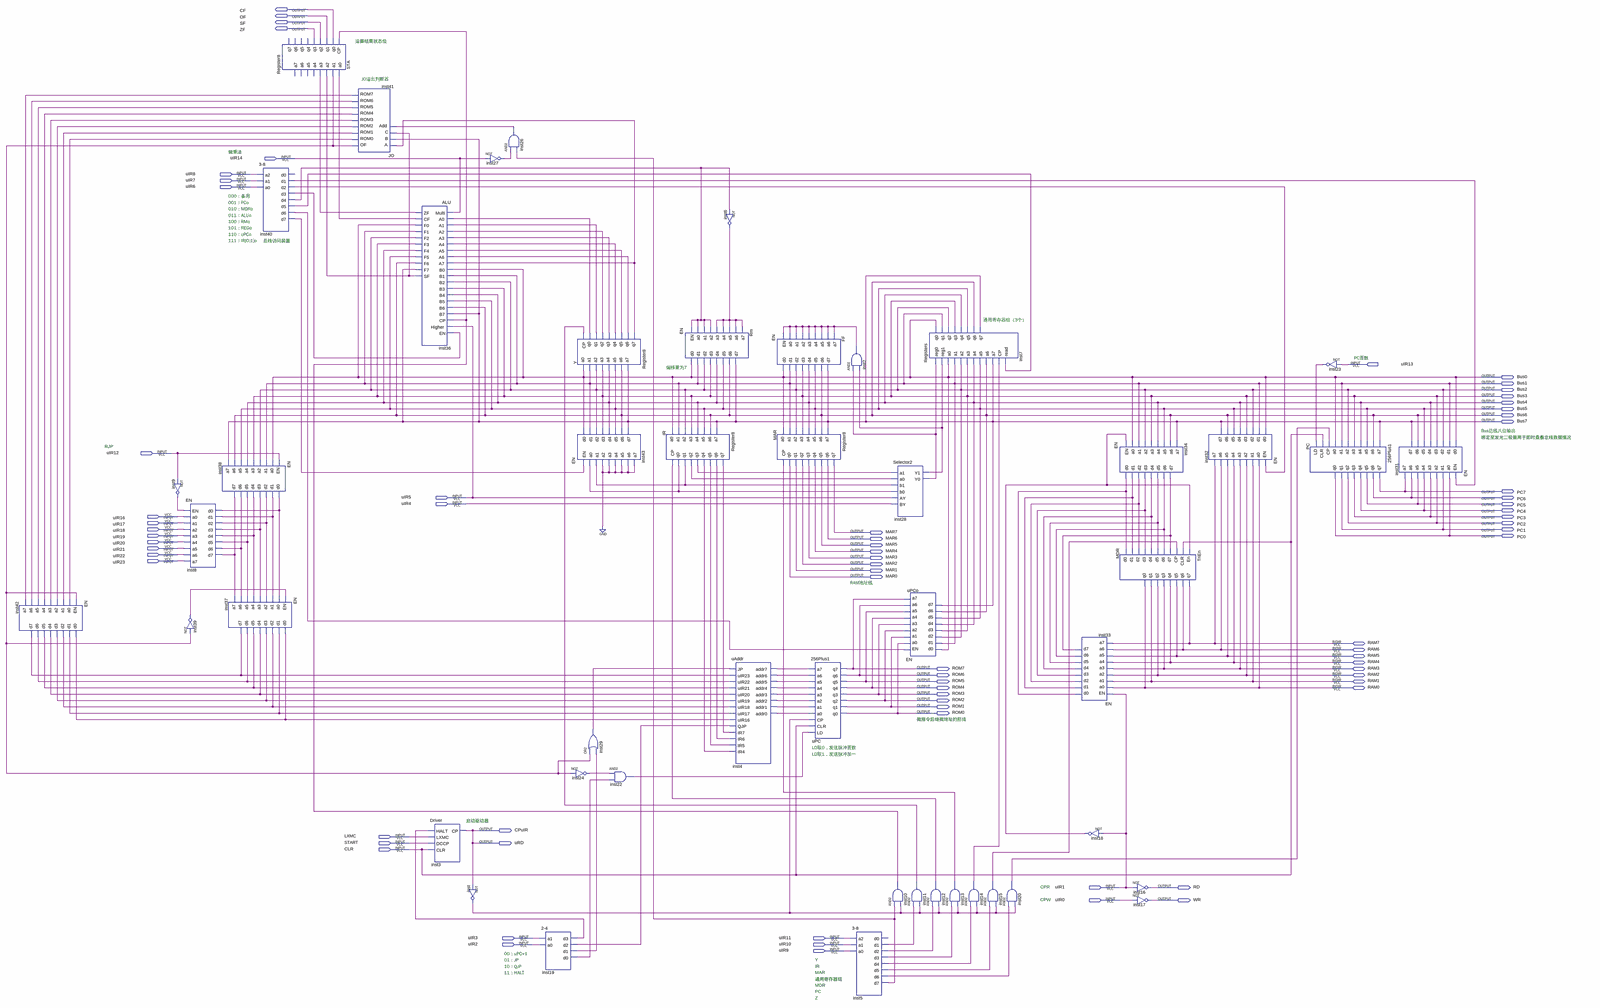
[diagram p0: schematic sheet, whole]
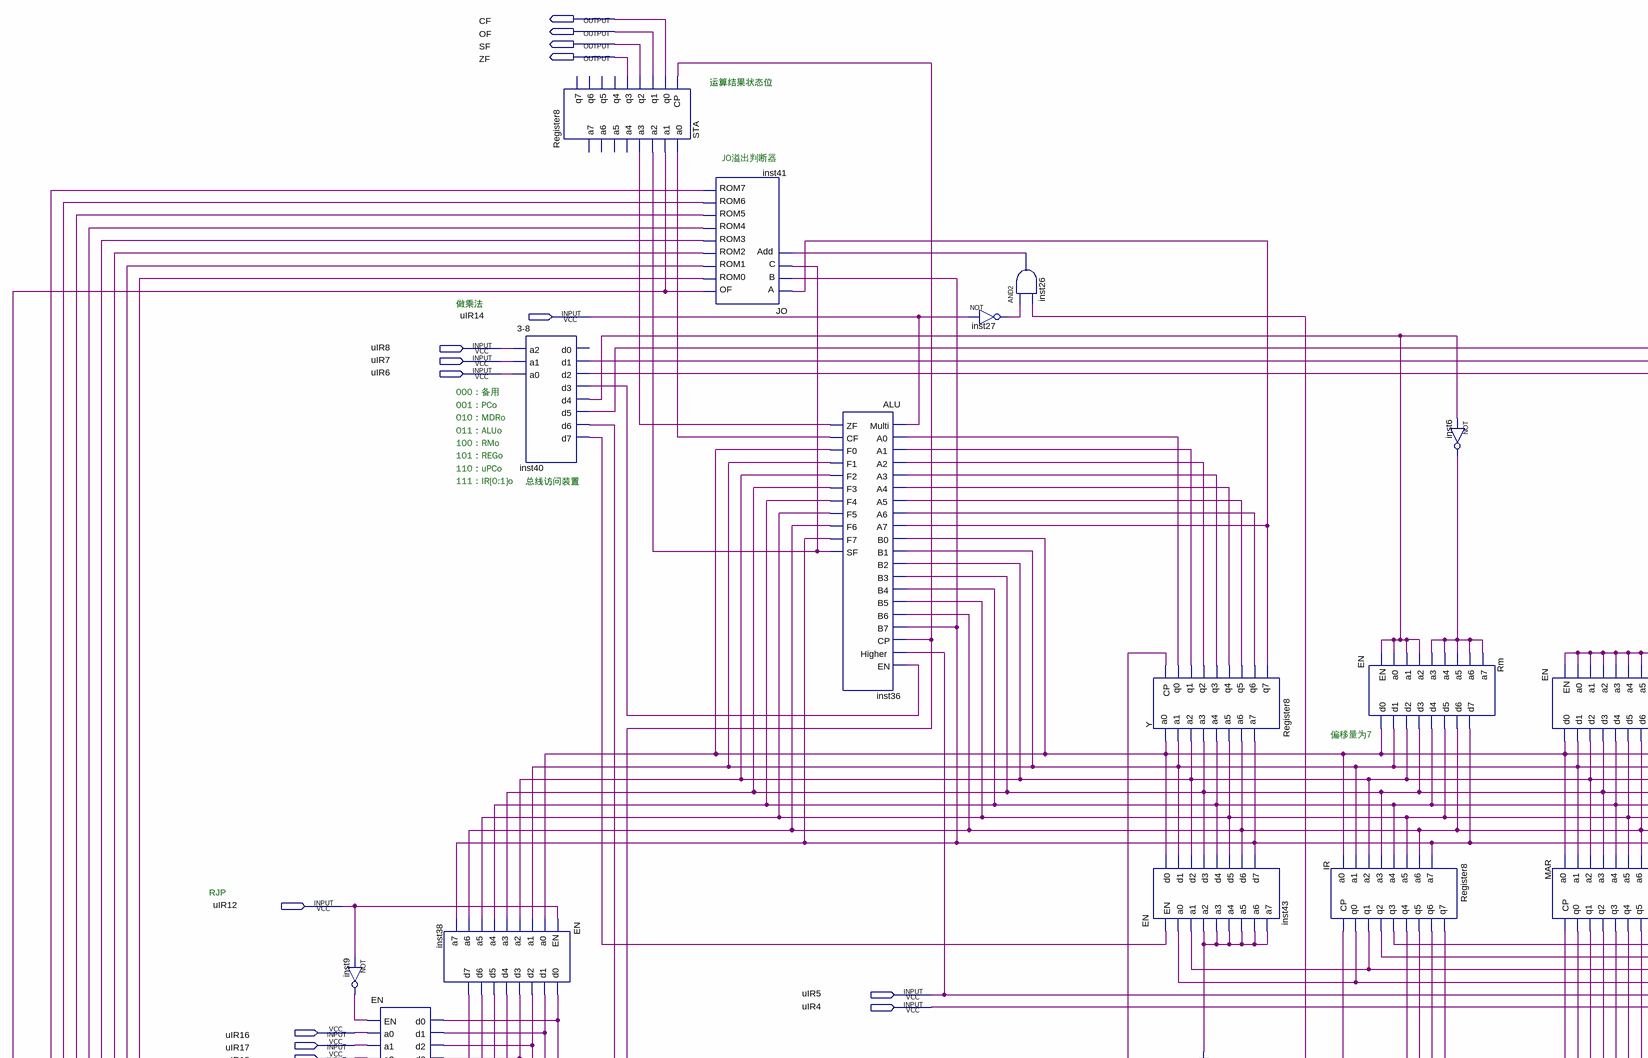
[diagram p1: schematic sheet, upper left part]
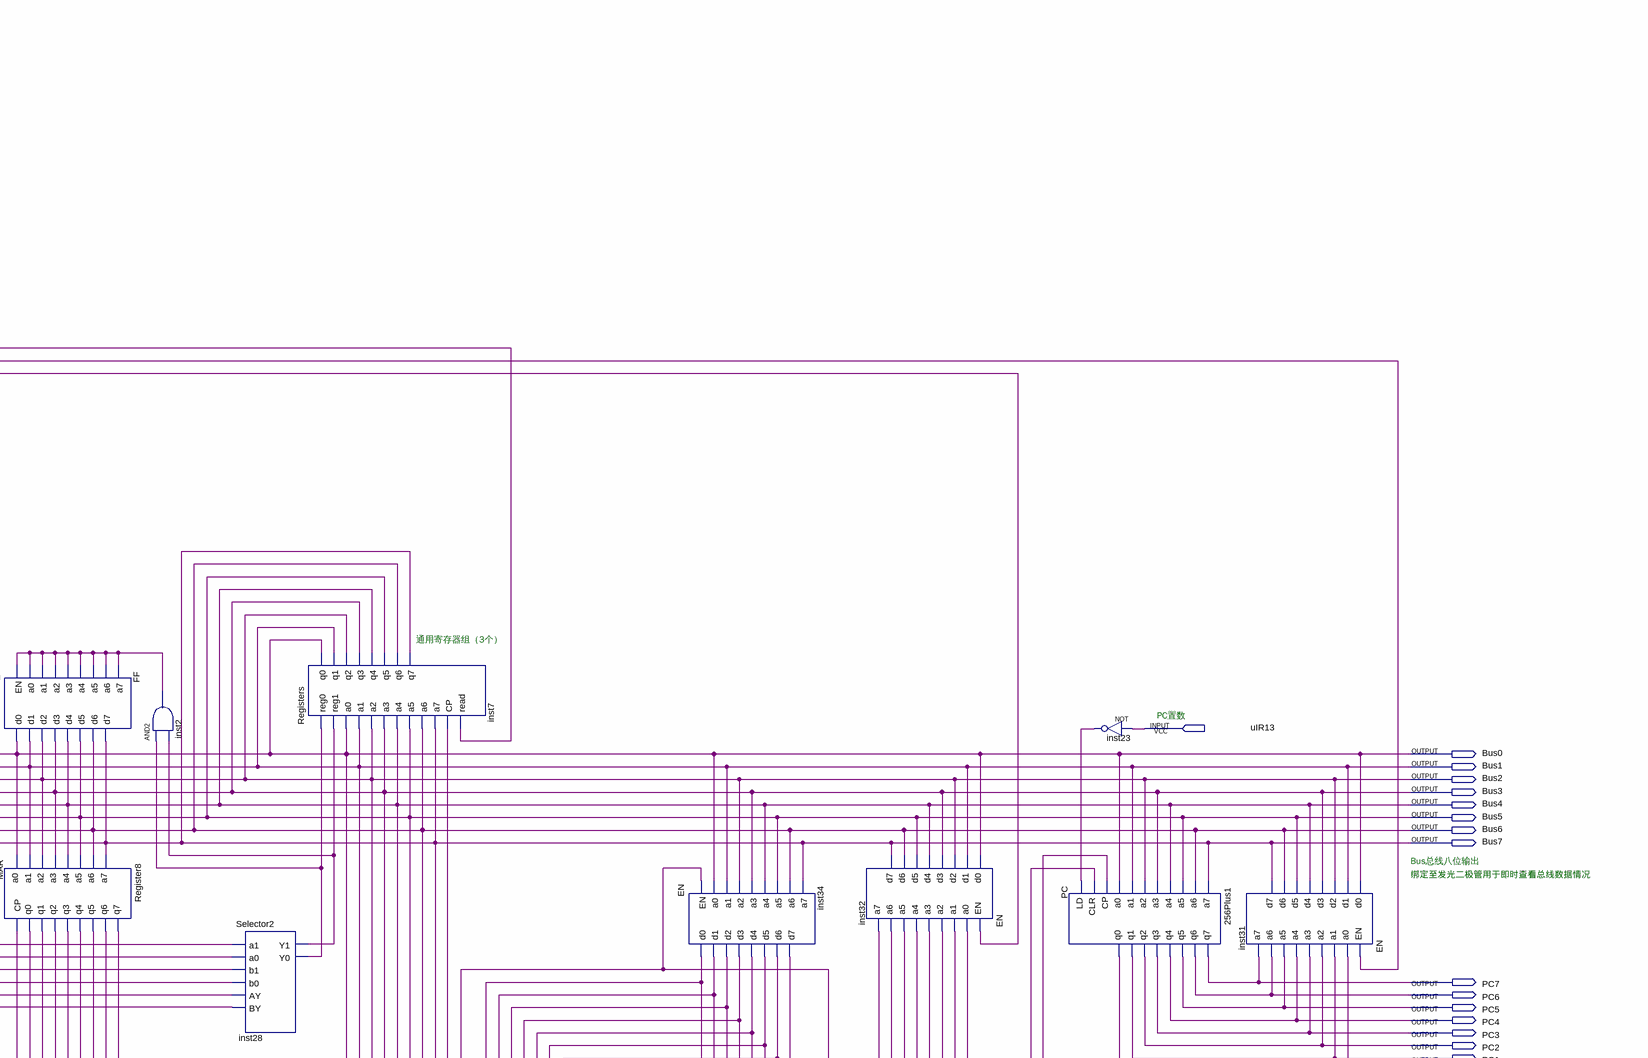
[diagram p2: schematic sheet, upper right part]
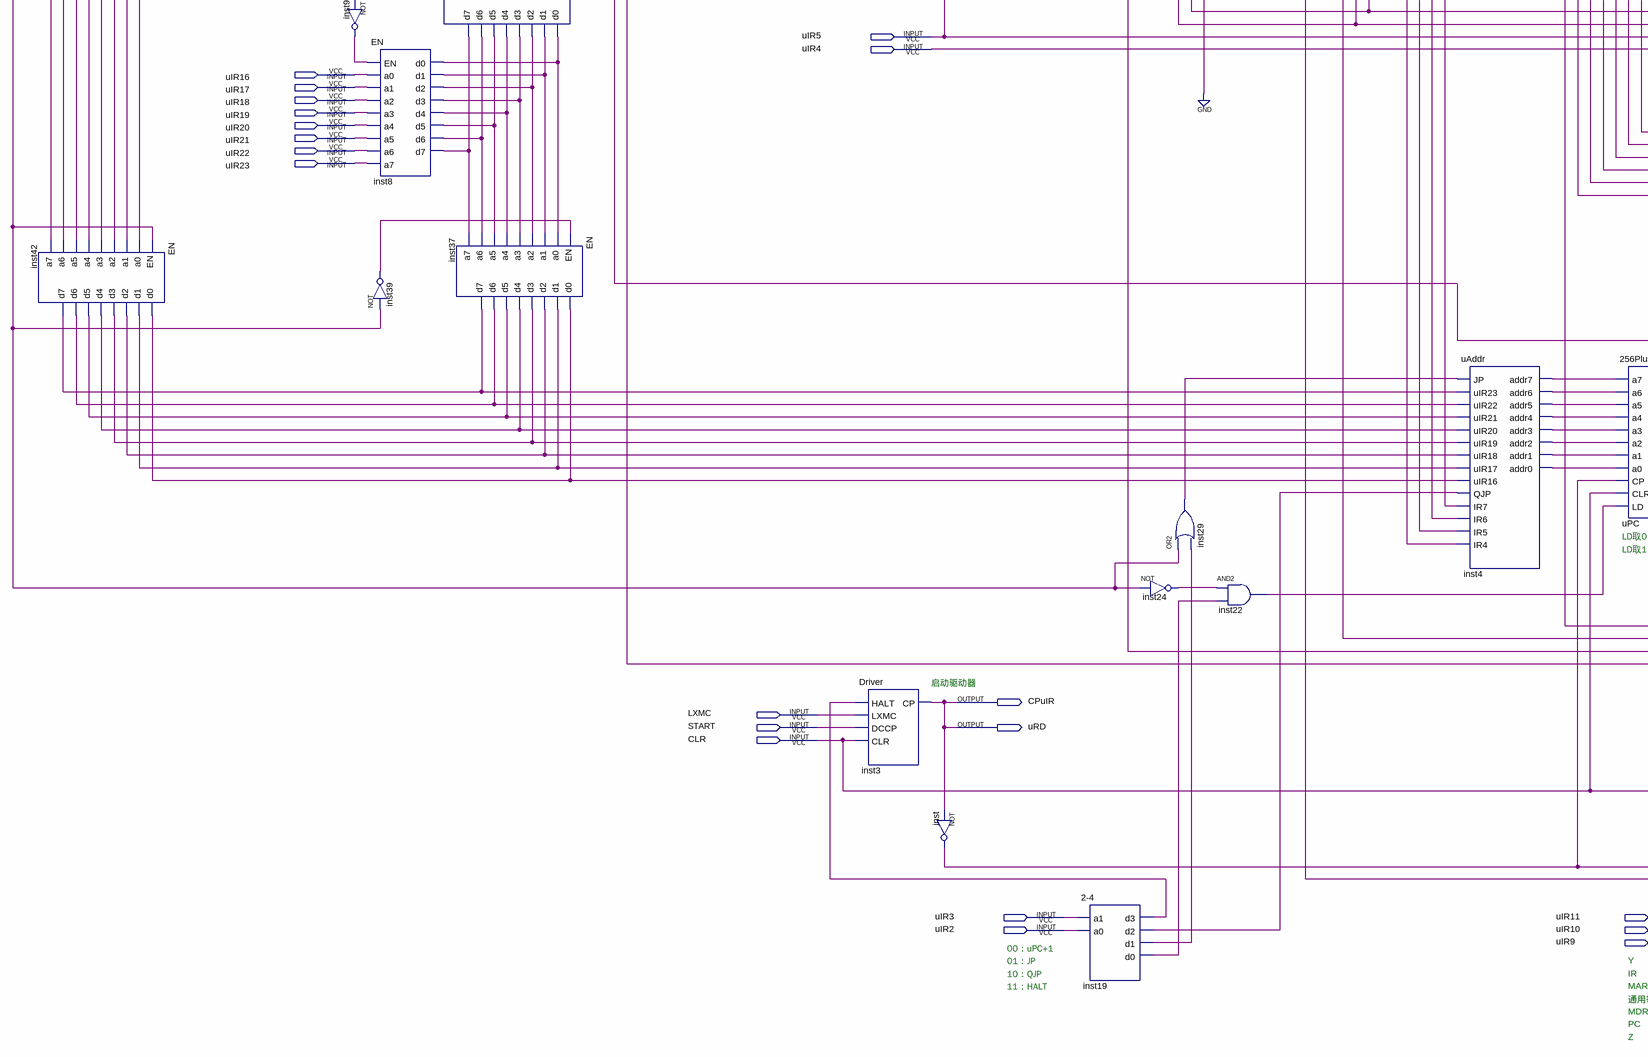
[diagram p3: schematic sheet, lower left part]
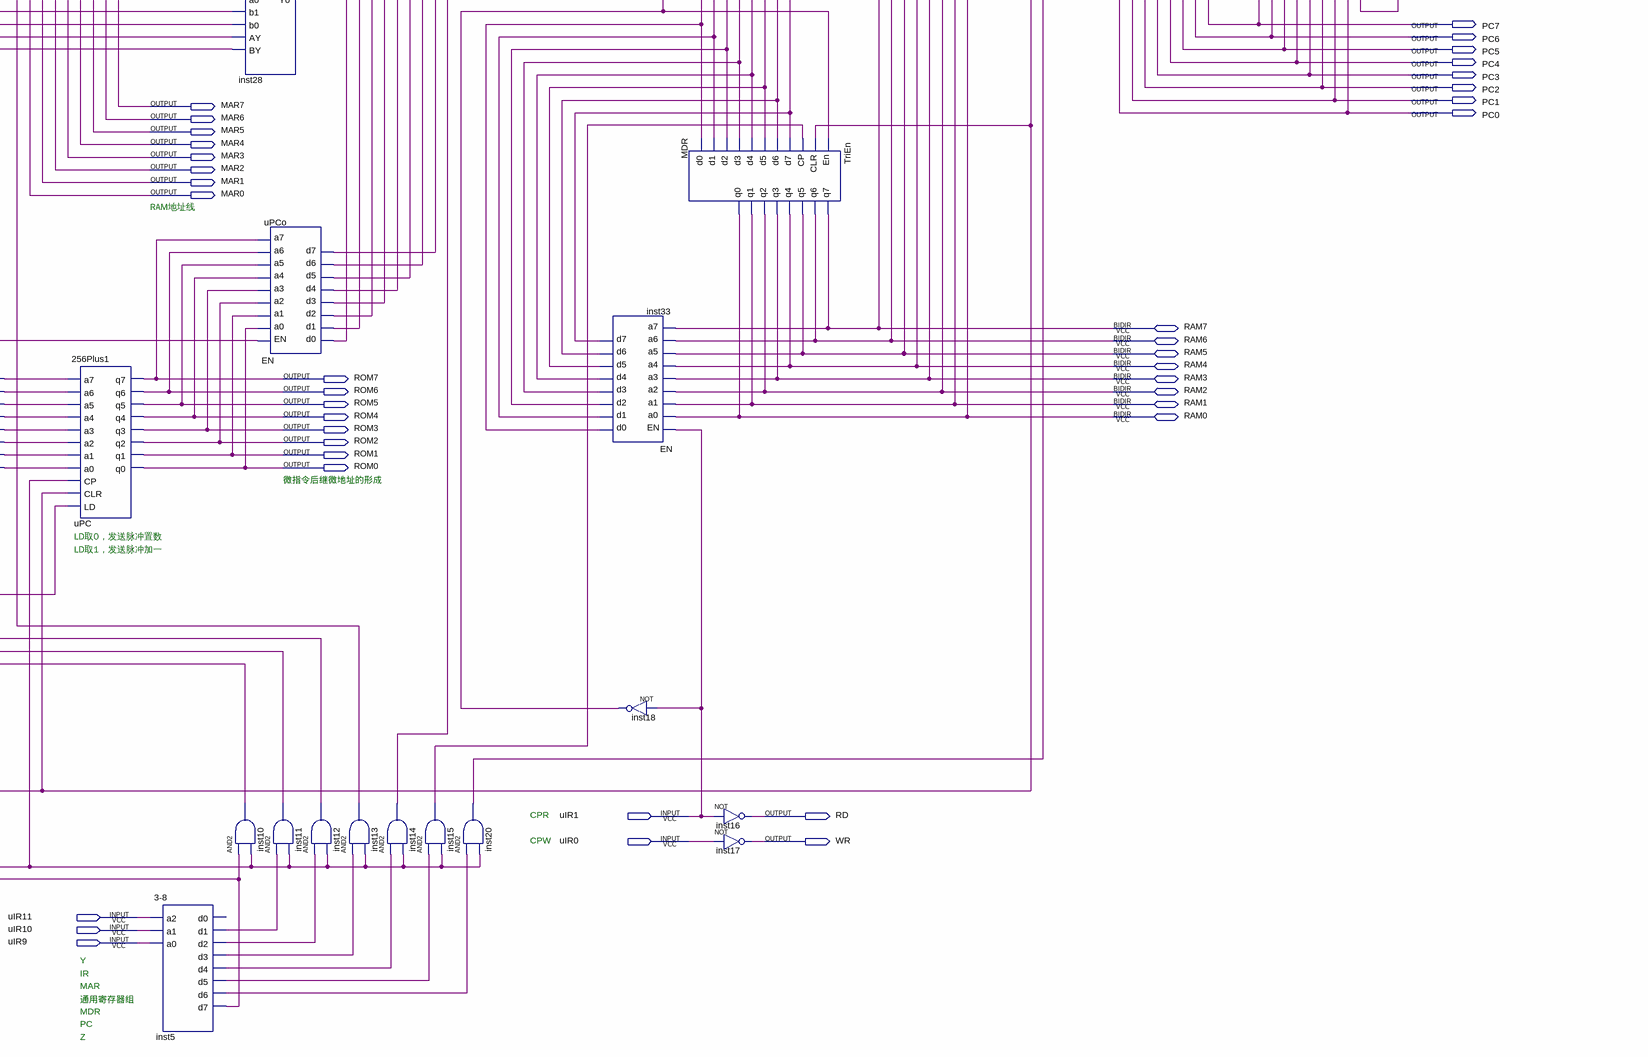
[diagram p4: schematic sheet, lower right part]
// Quartus schematic Remake.bdf as structural Verilog: 49 symbols, 74 pins
module Remake (
  input  uIR14,
  input  uIR8,
  input  uIR7,
  input  uIR6,
  input  uIR13,
  input  uIR12,
  input  uIR5,
  input  uIR4,
  input  uIR16,
  input  uIR17,
  input  uIR18,
  input  uIR19,
  input  uIR20,
  input  uIR21,
  input  uIR22,
  input  uIR23,
  input  LXMC,
  input  START,
  input  CLR,
  input  uIR1,
  input  uIR0,
  input  uIR3,
  input  uIR11,
  input  uIR2,
  input  uIR10,
  input  uIR9,
  inout  RAM7,
  inout  RAM6,
  inout  RAM5,
  inout  RAM4,
  inout  RAM3,
  inout  RAM2,
  inout  RAM1,
  inout  RAM0,
  output CF,
  output OF,
  output SF,
  output ZF,
  output Bus0,
  output Bus1,
  output Bus2,
  output Bus3,
  output Bus4,
  output Bus5,
  output Bus6,
  output Bus7,
  output PC7,
  output PC6,
  output PC5,
  output PC4,
  output PC3,
  output PC2,
  output PC1,
  output MAR7,
  output PC0,
  output MAR6,
  output MAR5,
  output MAR4,
  output MAR3,
  output MAR2,
  output MAR1,
  output MAR0,
  output ROM7,
  output ROM6,
  output ROM5,
  output ROM4,
  output ROM3,
  output ROM2,
  output ROM1,
  output ROM0,
  output CPuIR,
  output uRD,
  output RD,
  output WR
);

  wire inst2_out, inst4_addr0, inst4_addr1, inst4_addr2, inst4_addr3, inst4_addr4, inst4_addr5, inst4_addr6,
       inst4_addr7, inst5_d1, inst5_d2, inst5_d3, inst5_d4, inst5_d5, inst5_d6, inst5_d7, inst6_out,
       inst8_d0, inst8_d1, inst8_d2, inst8_d3, inst8_d4, inst8_d5, inst8_d6, inst8_d7, inst9_out, inst10_out,
       inst11_out, inst12_out, inst13_out, inst14_out, inst15_out, inst18_out, inst19_d0, inst19_d1,
       inst19_d2, inst19_d3, inst20_out, inst22_out, inst23_out, inst24_out, inst26_out, inst27_out,
       inst28_y0, inst28_y1, inst29_out, inst33_d0, inst33_d1, inst33_d2, inst33_d3, inst33_d4, inst33_d5,
       inst33_d6, inst33_d7, inst36_cf, inst36_sf, inst36_zf, inst39_out, inst40_d1, inst40_d2, inst40_d3,
       inst40_d4, inst40_d5, inst40_d6, inst40_d7, inst41_of, inst41_rom0, inst41_rom1, inst41_rom2,
       inst41_rom3, inst41_rom4, inst41_rom5, inst41_rom6, inst41_rom7, inst42_d0, inst42_d1, inst42_d2,
       inst42_d3, inst42_d4, inst42_d5, inst42_d6, inst42_d7, inst_out, IR_q0, IR_q1, IR_q2, IR_q3, IR_q4,
       IR_q5, IR_q6, IR_q7, Y_q0, Y_q1, Y_q2, Y_q3, Y_q4, Y_q5, Y_q6, Y_q7;

  EN inst42 (
    .EN(inst41_of), .a0(inst41_rom0), .a1(inst41_rom1), .a2(inst41_rom2), .a3(inst41_rom3), .a4(inst41_rom4),
    .a5(inst41_rom5), .a6(inst41_rom6), .a7(inst41_rom7), .d0(inst42_d0), .d1(inst42_d1), .d2(inst42_d2),
    .d3(inst42_d3), .d4(inst42_d4), .d5(inst42_d5), .d6(inst42_d6), .d7(inst42_d7));
  not inst9 (inst9_out, uIR12);
  EN inst8 (
    .EN(inst9_out), .a0(uIR16), .a1(uIR17), .a2(uIR18), .a3(uIR19), .a4(uIR20), .a5(uIR21), .a6(uIR22),
    .a7(uIR23), .d0(inst8_d0), .d1(inst8_d1), .d2(inst8_d2), .d3(inst8_d3), .d4(inst8_d4), .d5(inst8_d5),
    .d6(inst8_d6), .d7(inst8_d7));
  not inst39 (inst39_out, inst41_of);
  EN inst38 (
    .EN(uIR12), .a0(Bus0), .a1(Bus1), .a2(Bus2), .a3(Bus3), .a4(Bus4), .a5(Bus5), .a6(Bus6), .a7(Bus7),
    .d0(inst8_d0), .d1(inst8_d1), .d2(inst8_d2), .d3(inst8_d3), .d4(inst8_d4), .d5(inst8_d5), .d6(inst8_d6),
    .d7(inst8_d7));
  EN inst37 (
    .EN(inst39_out), .a0(inst8_d0), .a1(inst8_d1), .a2(inst8_d2), .a3(inst8_d3), .a4(inst8_d4),
    .a5(inst8_d5), .a6(inst8_d6), .a7(inst8_d7), .d0(inst42_d0), .d1(inst42_d1), .d2(inst42_d2),
    .d3(inst42_d3), .d4(inst42_d4), .d5(inst42_d5), .d6(inst42_d6), .d7(inst42_d7));
  Register8 STA (
    .CP(inst10_out), .a3(inst36_zf), .a2(inst36_sf), .a1(inst41_of), .a0(inst36_cf), .q3(ZF), .q2(SF),
    .q1(OF), .q0(CF));  // open: a7, a6, a5, a4, q7, q6, q5, q4
  \3-8  inst40 (
    .a2(uIR8), .a1(uIR7), .a0(uIR6), .d7(inst40_d7), .d6(inst40_d6), .d5(inst40_d5), .d4(inst40_d4),
    .d3(inst40_d3), .d2(inst40_d2), .d1(inst40_d1));  // open: d0
  JO inst41 (
    .A(Y_q7), .B(Bus7), .C(inst36_sf), .Add(inst26_out), .OF(inst41_of), .ROM0(inst41_rom0),
    .ROM1(inst41_rom1), .ROM2(inst41_rom2), .ROM3(inst41_rom3), .ROM4(inst41_rom4), .ROM5(inst41_rom5),
    .ROM6(inst41_rom6), .ROM7(inst41_rom7));
  ALU inst36 (
    .Multi(uIR14), .A0(Y_q0), .A1(Y_q1), .A2(Y_q2), .A3(Y_q3), .A4(Y_q4), .A5(Y_q5), .A6(Y_q6), .A7(Y_q7),
    .B0(Bus0), .B1(Bus1), .B2(Bus2), .B3(Bus3), .B4(Bus4), .B5(Bus5), .B6(Bus6), .B7(Bus7), .CP(inst10_out),
    .Higher(uIR5), .EN(inst40_d3), .ZF(inst36_zf), .CF(inst36_cf), .F0(Bus0), .F1(Bus1), .F2(Bus2),
    .F3(Bus3), .F4(Bus4), .F5(Bus5), .F6(Bus6), .F7(Bus7), .SF(inst36_sf));
  Driver inst3 (.HALT(inst19_d3), .LXMC(LXMC), .DCCP(START), .CLR(CLR), .CP(CPuIR));
  not inst (inst_out, CPuIR);
  and inst26 (inst26_out, inst27_out, inst5_d7);
  not inst27 (inst27_out, uIR14);
  \2-4  inst19 (.a1(uIR3), .a0(uIR2), .d3(inst19_d3), .d2(inst19_d2), .d1(inst19_d1), .d0(inst19_d0));
  Register8 Y (
    .CP(inst11_out), .a7(Bus7), .a6(Bus6), .a5(Bus5), .a4(Bus4), .a3(Bus3), .a2(Bus2), .a1(Bus1), .a0(Bus0),
    .q7(Y_q7), .q6(Y_q6), .q5(Y_q5), .q4(Y_q4), .q3(Y_q3), .q2(Y_q2), .q1(Y_q1), .q0(Y_q0));
  EN inst43 (
    .EN(inst40_d7), .a0(IR_q0), .a1(IR_q1), .a2(1'b0), .a3(1'b0), .a4(1'b0), .a5(1'b0), .a6(1'b0), .a7(1'b0),
    .d0(Bus0), .d1(Bus1), .d2(Bus2), .d3(Bus3), .d4(Bus4), .d5(Bus5), .d6(Bus6), .d7(Bus7));
  or inst29 (inst29_out, inst41_of, inst19_d1);
  not inst24 (inst24_out, inst41_of);
  and inst22 (inst22_out, inst24_out, inst19_d0);
  Register8 IR (
    .CP(inst12_out), .a7(Bus7), .a6(Bus6), .a5(Bus5), .a4(Bus4), .a3(Bus3), .a2(Bus2), .a1(Bus1), .a0(Bus0),
    .q7(IR_q7), .q6(IR_q6), .q5(IR_q5), .q4(IR_q4), .q3(IR_q3), .q2(IR_q2), .q1(IR_q1), .q0(IR_q0));
  EN Rm (
    .EN(inst40_d4), .a0(inst40_d4), .a1(inst40_d4), .a2(inst40_d4), .a3(inst6_out), .a4(inst6_out),
    .a5(inst6_out), .a6(inst6_out), .a7(inst6_out), .d0(Bus0), .d1(Bus1), .d2(Bus2), .d3(Bus3), .d4(Bus4),
    .d5(Bus5), .d6(Bus6), .d7(Bus7));
  not inst6 (inst6_out, inst40_d4);
  uAddr inst4 (
    .JP(inst29_out), .uIR23(inst42_d7), .uIR22(inst42_d6), .uIR21(inst42_d5), .uIR20(inst42_d4),
    .uIR19(inst42_d3), .uIR18(inst42_d2), .uIR17(inst42_d1), .uIR16(inst42_d0), .QJP(inst19_d2), .IR7(IR_q7),
    .IR6(IR_q6), .IR5(IR_q5), .IR4(IR_q4), .addr7(inst4_addr7), .addr6(inst4_addr6), .addr5(inst4_addr5),
    .addr4(inst4_addr4), .addr3(inst4_addr3), .addr2(inst4_addr2), .addr1(inst4_addr1), .addr0(inst4_addr0));
  EN FF (
    .EN(inst2_out), .a0(inst2_out), .a1(inst2_out), .a2(inst2_out), .a3(inst2_out), .a4(inst2_out),
    .a5(inst2_out), .a6(inst2_out), .a7(inst2_out), .d0(Bus0), .d1(Bus1), .d2(Bus2), .d3(Bus3), .d4(Bus4),
    .d5(Bus5), .d6(Bus6), .d7(Bus7));
  Register8 MAR (
    .CP(inst13_out), .a7(Bus7), .a6(Bus6), .a5(Bus5), .a4(Bus4), .a3(Bus3), .a2(Bus2), .a1(Bus1), .a0(Bus0),
    .q7(MAR7), .q6(MAR6), .q5(MAR5), .q4(MAR4), .q3(MAR3), .q2(MAR2), .q1(MAR1), .q0(MAR0));
  \256Plus1  uPC (
    .a7(inst4_addr7), .a6(inst4_addr6), .a5(inst4_addr5), .a4(inst4_addr4), .a3(inst4_addr3),
    .a2(inst4_addr2), .a1(inst4_addr1), .a0(inst4_addr0), .CP(inst_out), .CLR(CLR), .LD(inst22_out),
    .q7(ROM7), .q6(ROM6), .q5(ROM5), .q4(ROM4), .q3(ROM3), .q2(ROM2), .q1(ROM1), .q0(ROM0));
  and inst2 (inst2_out, inst28_y0, inst28_y1);
  \3-8  inst5 (
    .a2(uIR11), .a1(uIR10), .a0(uIR9), .d7(inst5_d7), .d6(inst5_d6), .d5(inst5_d5), .d4(inst5_d4),
    .d3(inst5_d3), .d2(inst5_d2), .d1(inst5_d1));  // open: d0
  and inst10 (inst10_out, inst5_d7, inst_out);
  Selector2 inst28 (
    .a1(IR_q3), .b1(IR_q1), .a0(IR_q2), .b0(IR_q0), .AY(uIR5), .BY(uIR4), .Y1(inst28_y1), .Y0(inst28_y0));
  EN uPCo (
    .EN(inst40_d6), .a0(ROM0), .a1(ROM1), .a2(ROM2), .a3(ROM3), .a4(ROM4), .a5(ROM5), .a6(ROM6), .a7(ROM7),
    .d0(Bus0), .d1(Bus1), .d2(Bus2), .d3(Bus3), .d4(Bus4), .d5(Bus5), .d6(Bus6), .d7(Bus7));
  and inst11 (inst11_out, inst5_d1, inst_out);
  Registers inst7 (
    .reg0(inst28_y0), .reg1(inst28_y1), .a0(Bus0), .a1(Bus1), .a2(Bus2), .a3(Bus3), .a4(Bus4), .a5(Bus5),
    .a6(Bus6), .a7(Bus7), .CP(inst14_out), .read(inst40_d5), .q0(Bus0), .q1(Bus1), .q2(Bus2), .q3(Bus3),
    .q4(Bus4), .q5(Bus5), .q6(Bus6), .q7(Bus7));
  and inst12 (inst12_out, inst5_d2, inst_out);
  and inst13 (inst13_out, inst5_d3, inst_out);
  and inst14 (inst14_out, inst5_d4, inst_out);
  and inst15 (inst15_out, inst5_d5, inst_out);
  and inst20 (inst20_out, inst5_d6, inst_out);
  EN inst33 (
    .EN(uIR1), .a0(RAM0), .a1(RAM1), .a2(RAM2), .a3(RAM3), .a4(RAM4), .a5(RAM5), .a6(RAM6), .a7(RAM7),
    .d0(inst33_d0), .d1(inst33_d1), .d2(inst33_d2), .d3(inst33_d3), .d4(inst33_d4), .d5(inst33_d5),
    .d6(inst33_d6), .d7(inst33_d7));
  not inst18 (inst18_out, uIR1);
  EN inst34 (
    .EN(inst18_out), .a0(Bus0), .a1(Bus1), .a2(Bus2), .a3(Bus3), .a4(Bus4), .a5(Bus5), .a6(Bus6), .a7(Bus7),
    .d0(inst33_d0), .d1(inst33_d1), .d2(inst33_d2), .d3(inst33_d3), .d4(inst33_d4), .d5(inst33_d5),
    .d6(inst33_d6), .d7(inst33_d7));
  TriEn MDR (
    .En(inst18_out), .CLR(CLR), .CP(inst15_out), .d7(inst33_d7), .d6(inst33_d6), .d5(inst33_d5),
    .d4(inst33_d4), .d3(inst33_d3), .d2(inst33_d2), .d1(inst33_d1), .d0(inst33_d0), .q7(RAM7), .q6(RAM6),
    .q5(RAM5), .q4(RAM4), .q3(RAM3), .q2(RAM2), .q1(RAM1), .q0(RAM0));
  not inst16 (RD, uIR1);
  not inst17 (WR, uIR0);
  EN inst32 (
    .EN(inst40_d2), .a0(RAM0), .a1(RAM1), .a2(RAM2), .a3(RAM3), .a4(RAM4), .a5(RAM5), .a6(RAM6), .a7(RAM7),
    .d0(Bus0), .d1(Bus1), .d2(Bus2), .d3(Bus3), .d4(Bus4), .d5(Bus5), .d6(Bus6), .d7(Bus7));
  \256Plus1  PC (
    .a7(Bus7), .a6(Bus6), .a5(Bus5), .a4(Bus4), .a3(Bus3), .a2(Bus2), .a1(Bus1), .a0(Bus0), .CP(inst20_out),
    .CLR(CLR), .LD(inst23_out), .q7(PC7), .q6(PC6), .q5(PC5), .q4(PC4), .q3(PC3), .q2(PC2), .q1(PC1), .q0(PC0));
  not inst23 (inst23_out, uIR13);
  EN inst31 (
    .EN(inst40_d1), .a0(PC0), .a1(PC1), .a2(PC2), .a3(PC3), .a4(PC4), .a5(PC5), .a6(PC6), .a7(PC7),
    .d0(Bus0), .d1(Bus1), .d2(Bus2), .d3(Bus3), .d4(Bus4), .d5(Bus5), .d6(Bus6), .d7(Bus7));

  assign uRD = CPuIR;

  // Notes on the sheet:
  //   运算结果状态位
  //   JO溢出判断器
  //   做乘法
  //   000：备用
  //   001：PCo
  //   010：MDRo
  //   011：ALUo
  //   100：RMo
  //   101：REGo
  //   110：uPCo
  //   111：IR[0:1]o
  //   总线访问装置
  //   通用寄存器组（3个）
  //   PC置数
  //   偏移量为7
  //   Bus总线八位输出
  //   绑定至发光二极管用于即时查看总线数据情况
  //   RJP
  //   RAM地址线
  //   微指令后继微地址的形成
  //   LD取0，发送脉冲置数
  //   LD取1，发送脉冲加一
  //   启动驱动器
  //   CPR
  //   CPW
  //   00：uPC+1
  //   01：JP
  //   Y
  //   10：QJP
  //   IR
  //   11：HALT
  //   MAR
  //   通用寄存器组
  //   MDR
  //   PC
  //   Z
endmodule
